# Altium schematic sheet Power.SchDoc
size A3; SheetNumber: 5; SheetTotal: 5
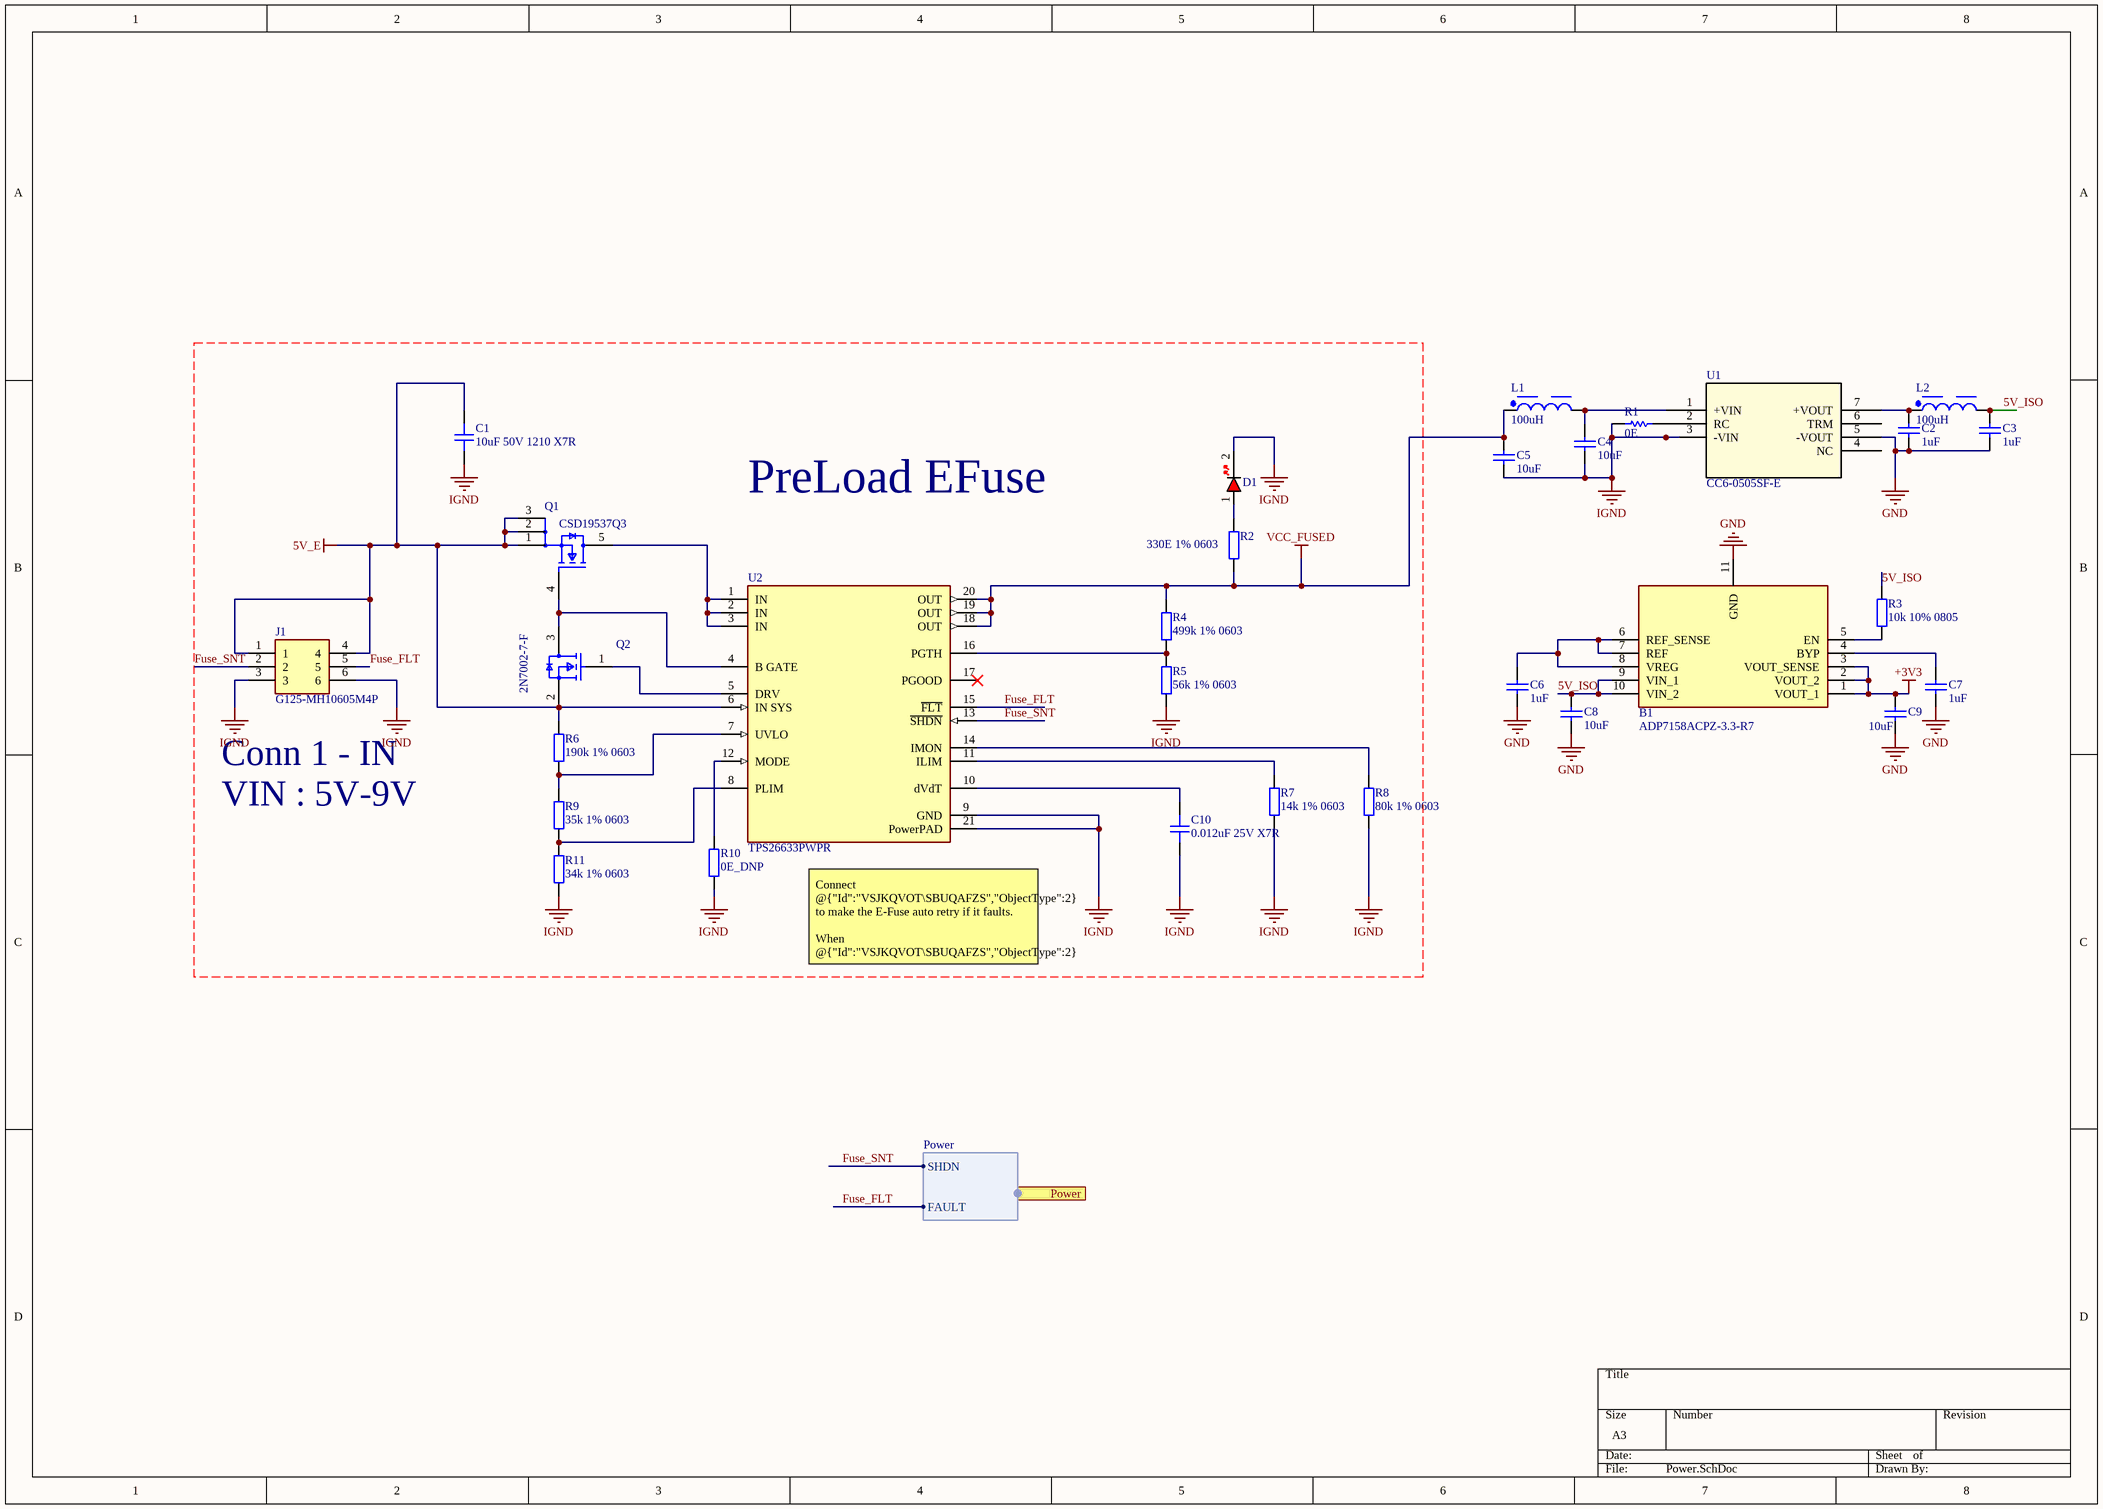
[diagram p0: Power.SchDoc]

## Parts
B1  ADP7158ACPZ-3.3-R7  [LFCSP -10]
C1  10uF 50V 1210 X7R  [CAP1210S]
C2  1uF  [CAP0603S]
C3  1uF  [CAP0603S]
C4  10uF  [CAP0603S]
C5  10uF  [CAP0603S]
C6  1uF  [CAP0603S]
C7  1uF  [CAP0603S]
C8  10uF  [CAP0603S]
C9  10uF  [CAP0603S]
C10  0.012uF 25V X7R  [CAP0805S]
D1  RED  [LED 0603_RED]  (value not drawn)
J1  G125-MH10605M4P  [HARWIN_G125-MH10605M4P]
L1  100uH  [IND_SEMI_SHIELD_6.0X6.0_H4.5_SMD]
L2  100uH  [IND_SEMI_SHIELD_6.0X6.0_H4.5_SMD]
Q1  CSD19537Q3  [TRANS_CSD19537Q3]
Q2  2N7002-7-F  [SOT23_3]
R1  0E  [RES0402S]
R2  330E 1% 0603  [RES0603S]
R3  10k 10% 0805  [RES0805S]
R4  499k 1% 0603  [RES0603S]
R5  56k 1% 0603  [RES0603S]
R6  190k 1% 0603  [RES0603S]
R7  14k 1% 0603  [RES0603S]
R8  80k 1% 0603  [RES0402S]
R9  35k 1% 0603  [RES0603S]
R10  0E_DNP  [RES0603S]
R11  34k 1% 0603  [RES0603S]
U1  CC6-0505SF-E  [CONV_CC6-0505SF-E]
U2  TPS26633PWPR  [SOP65P640X110-21N]

## Ports
Power (harness Power)

## Harnesses
Power: SHDN, FAULT

## Nets
5V_E: C1.2 J1.1 J1.4 Q1.1(S) Q1.2(S) Q1.3(S) Q2.2(S) R6.2 U2.6(IN_SYS)
+3V3: B1.1(VOUT_1) B1.2(VOUT_2) B1.3(VOUT_SENSE) C9.1
GND: B1.11(GND) C2.2 C3.2 C6.2 C7.2 C8.2 C9.2 U1.5(-VOUT)
IGND: C1.1 C4.2 C5.2 C10.1 D1.2(K) J1.3 J1.6 R1.1 R5.1 R7.1 R8.1 R10.1 R11.1 U1.3(-VIN) U2.9(GND) U2.21(PowerPAD)
VCC_FUSED: C5.1 L1.1 R2.1 R4.2 U2.18(OUT) U2.19(OUT) U2.20(OUT)
5V_ISO: B1.9(VIN_1) B1.10(VIN_2) C3.1 C8.1 L2.2 R3.1
Fuse_FLT: J1.5 U2.15(~{FLT}) ; port Power.FAULT
Fuse_SNT: J1.2 U2.13(~{SHDN}) ; port Power.SHDN
NetB1_4: B1.4(BYP) C7.1
NetB1_5: B1.5(EN) R3.2
NetB1_6: B1.6(REF_SENSE) B1.7(REF) B1.8(VREG) C6.1
NetC2_1: C2.1 L2.1 U1.7(+VOUT)
NetC4_1: C4.1 L1.2 U1.1(+VIN)
NetC10_2: C10.2 U2.10(dVdT)
NetD1_1: D1.1(A) R2.2
NetQ1_4: Q1.4(G) Q2.3(D) U2.4(B_GATE)
NetQ1_5: Q1.5(D) U2.1(IN) U2.2(IN) U2.3(IN)
NetQ2_1: Q2.1(G) U2.5(DRV)
NetR1_2: R1.2 U1.2(RC)
NetR4_1: R4.1 R5.2 U2.16(PGTH)
NetR6_1: R6.1 R9.2 U2.7(UVLO)
NetR7_2: R7.2 U2.11(ILIM)
NetR8_2: R8.2 U2.14(IMON)
NetR9_1: R9.1 R11.2 U2.8(PLIM)
NetR10_2: R10.2 U2.12(MODE)

Not connected (* = marked no-connect by the designer): U1 4(NC) 6(TRM); U2 17(PGOOD)*

## Notes on the sheet
- PreLoad EFuse
- Conn 1 - IN
- VIN : 5V-9V
- (near U2) Connect @{"Id":"VSJKQVOT\SBUQAFZS","ObjectType":2} to make the E-Fuse auto retry if it faults.
  When @{"Id":"VSJKQVOT\SBUQAFZS","ObjectType":2} is not connected the @{"Id":"VSJKQVOT\QRUFGIOD","ObjectType":1} has to be toggled externally to restart the E-Fuse

## Library data of the parts
B1 = ADP7158ACPZ-3.3-R7: LDO Voltage Regulators 3.3/5Vin 2A Ultra Low Noise LDO Fixed; Manufacturer_Name: Analog Devices; Geometry.Height: 0.85mm; Mouser Part Number: 584-ADP7158ACPZ3.3R7; Mouser Price/Stock: https://www.mouser.co.uk/ProductDetail/Analog-Devices/ADP7158ACPZ-3.3-R7?qs=JeIcUl65ClCPnjVOMj%2F7AA%3D%3D; Manufacturer_Part_Number: ADP7158ACPZ-3.3-R7; Datasheet Link: http://www.analog.com/media/en/technical-documentation/data-sheets/ADP7158.pdf
C1 = CAP_1210: Capacitor SMD 1210; Manufacturer: *; Manufacturer Part Number: *; Distributor Link: *; LCSC: *; Rating: *; Dielectric: *
C2-C9 = CAP: Capacitor; Value: 100pF; Published: 8-Jun-2000; Revision: July-2002: Re-released for DXP Platform.; Publisher: Altium Limited
C10 = CAP_0603: Capacitor SMD 0603; Manufacturer: *; Manufacturer Part Number: *; Distributor Link: *; LCSC: *; Rating: *; Dielectric: *
D1 = LED_0603_RED: LED 0603 RED SMD
J1 = G125-MH10605M4P: Connector; Manufacturer_Name: Harwin; Datasheet Link: https://content.harwin.com/m/667f1be9427fb768/original/DRG-02921-Technical-Drawing-Datasheet-G125-MH1XX05M4P-pdf.pdf; Height: 5.25mm; Manufacturer_Part_Number: G125-MH10605M4P; Mouser Part Number: 855-G125MH1065M4PM4P; Mouser Price/Stock: https://www.mouser.co.uk/ProductDetail/Harwin/G125-MH10605M4P?qs=vHuUswq2%252BswF07IXFR1W6A%3D%3D
L1 L2 = CMP-1396-00036-2: NexarPartId: 22866940; Current Rating: 1.5A; Saturation Current: 1.8A; Self Resonant Frequency: 5.9MHz; Resistance: 198mΩ; Test Frequency: 100kHz; Inductance: 100µH; Inductance Tolerance: 20%; Shielding: Shielded; Core Material: Ferrite; DC Resistance (DCR): 165mΩ; Termination: SMD/SMT; Length: 10mm; Ambient Temperature Range High: 110°C; RMS Current (Irms): 1.5A; Packaging: Digi-Reel®; RoHS: Compliant; Series Resistance: 198mΩ; Ambient Temperature Range Low: -40°C; Case/Package: Nonstandard; Number of Pins: 2; Height: 5mm; Max Operating Temperature: 150°C; Min Operating Temperature: -40°C; REACH SVHC: Unknown; Height - Seated (Max): 5.0038mm; Width: 10mm; Tolerance: 20%; Max DC Current: 1.5A; Composition: Wirewound; Depth: 10mm; Mount: Surface Mount
Q1 = 7382af88e928fdc71488234cfaaf11c: MOSFET N-CH 100V 50A 8VSON; Max Power Dissipation: 2.8W; Turn-On Delay Time: 5ns; Gate to Source Voltage (Vgs): 20V; Input Capacitance: 1.68nF; Rds On Max: 14.5mR; Fall Time: 3ns; Turn-Off Delay Time: 10ns; Continuous Drain Current (ID): 50A; Lead Free: Contains Lead; Mount: Surface Mount; Number of Pins: 8; Min Operating Temperature: -55°C; Packaging: Rail/Tube; Rise Time: 3ns; Contact Plating: Copper; RoHS Compliant: Yes; Drain to Source Voltage (Vdss): 100V; Max Operating Temperature: 150°C
Q2 = 3b9c635fedb024a5347a57b145af9cc: MOSFET N-CH 60V 115MA SOT23-3; Turn-On Delay Time: 7ns; Turn-Off Delay Time: 11ns; Drain to Source Resistance: 7.5R; Rise Time: 3ns; Drain to Source Breakdown Voltage: 70V; Input Capacitance: 50pF; Number of Elements: 1; Power Dissipation: 540mW; Max Power Dissipation: 300mW; Fall Time: 5.6ns; Gate to Source Voltage (Vgs): 20V; Threshold Voltage: 2.5V; Element Configuration: Single; Termination: SMD/SMT; Weight: 0.000282oz; Radiation Hardening: No; Max Operating Temperature: 150°C; On-State Resistance: 7.5R; Mount: Surface Mount; Current Rating: 115mA; Contact Plating: Tin; Lead Free: Lead Free; Min Operating Temperature: -55°C; Number of Pins: 3; REACH SVHC: No SVHC; Drain to Source Voltage (Vdss): 60V; Width: 1.3mm; Package Quantity: 3000; Length: 2.9mm; Case/Package: SOT-23; Number of Channels: 1; Dual Supply Voltage: 60V; Packaging: Tape and Reel; Height: 1mm; Voltage Rating (DC): 60V; Nominal Vgs: 2.5V; Continuous Drain Current (ID): 115mA; Voltage: 60V; Rds On Max: 7.5R
R1 = res1: Resistor; Value: 1K; Published: 8-Jun-2000; Revision: July-2002: Re-released for DXP Platform.; Publisher: Altium Limited
R2 R4-R11 = RES_0603: Resistor SMD 0603; Manufacturer: *; Manufacturer Part Number: *; Distributor Link: *; LCSC: *
R3 = RES_0805: Resistor SMD 0805; Manufacturer: *; Manufacturer Part Number: *; Distributor Link: *; LCSC: *
U1 = CC6-0505SF-E: No Description Available; Mfr_Name: TDK; Type: Power Supplies Board Mount; RefDes: RefDes
U2 = 3aa6c8470eea581a3a5f71473fd1f1f: 4.5V - 60V 6A 29MOHM EFUSE